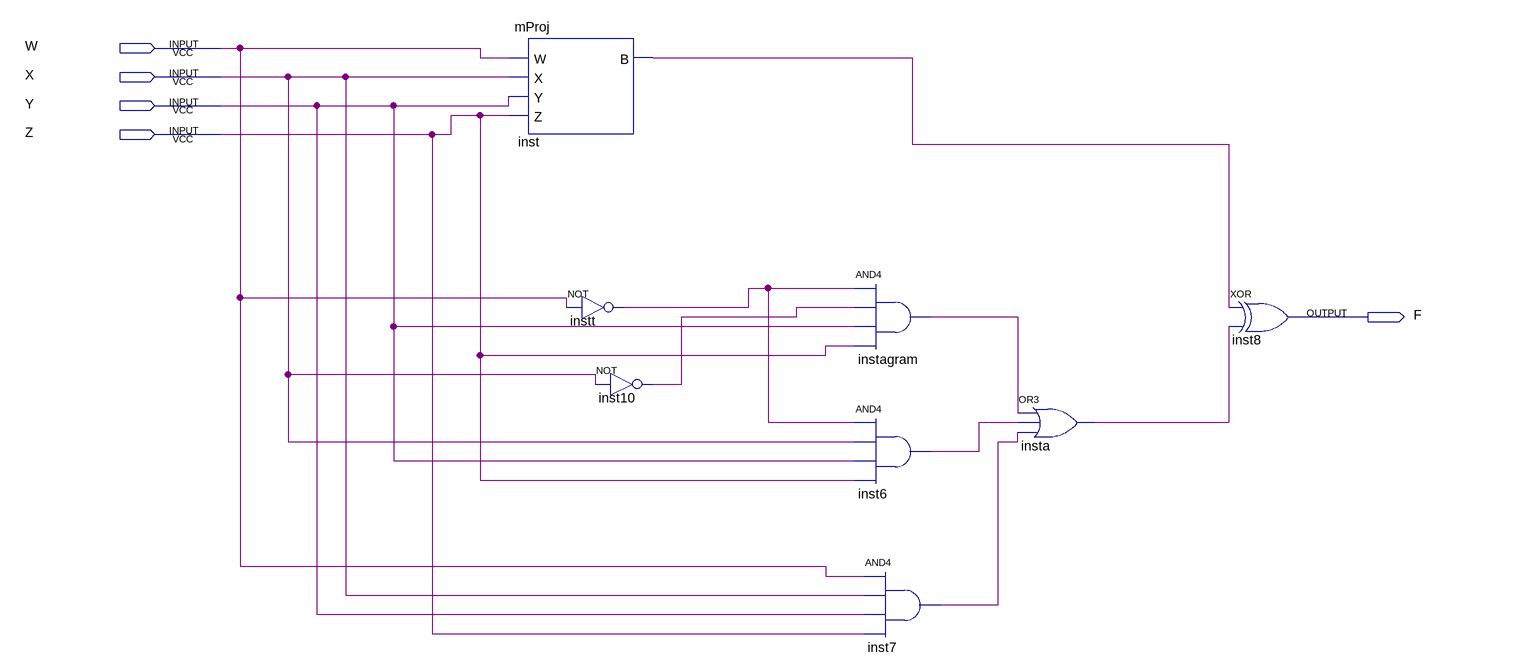
[diagram p0: schematic sheet]
// Quartus schematic q8.bdf as structural Verilog: 8 symbols, 5 pins
module q8 (
  input  W,
  input  X,
  input  Y,
  input  Z,
  output F
);

  wire inst6_out, inst7_out, inst10_out, inst_b, insta_out, instagram_out, instt_out;

  mProj inst (.W(W), .X(X), .Y(Y), .Z(Z), .B(inst_b));
  not instt (instt_out, W);
  not inst10 (inst10_out, X);
  and instagram (instagram_out, instt_out, inst10_out, Y, Z);
  and inst6 (inst6_out, instt_out, X, Y, Z);
  and inst7 (inst7_out, W, X, Y, Z);
  or insta (insta_out, instagram_out, inst6_out, inst7_out);
  xor inst8 (F, inst_b, insta_out);
endmodule
